# EAGLE schematic Mateusz.Płonka (EAGLE 9.5.1)
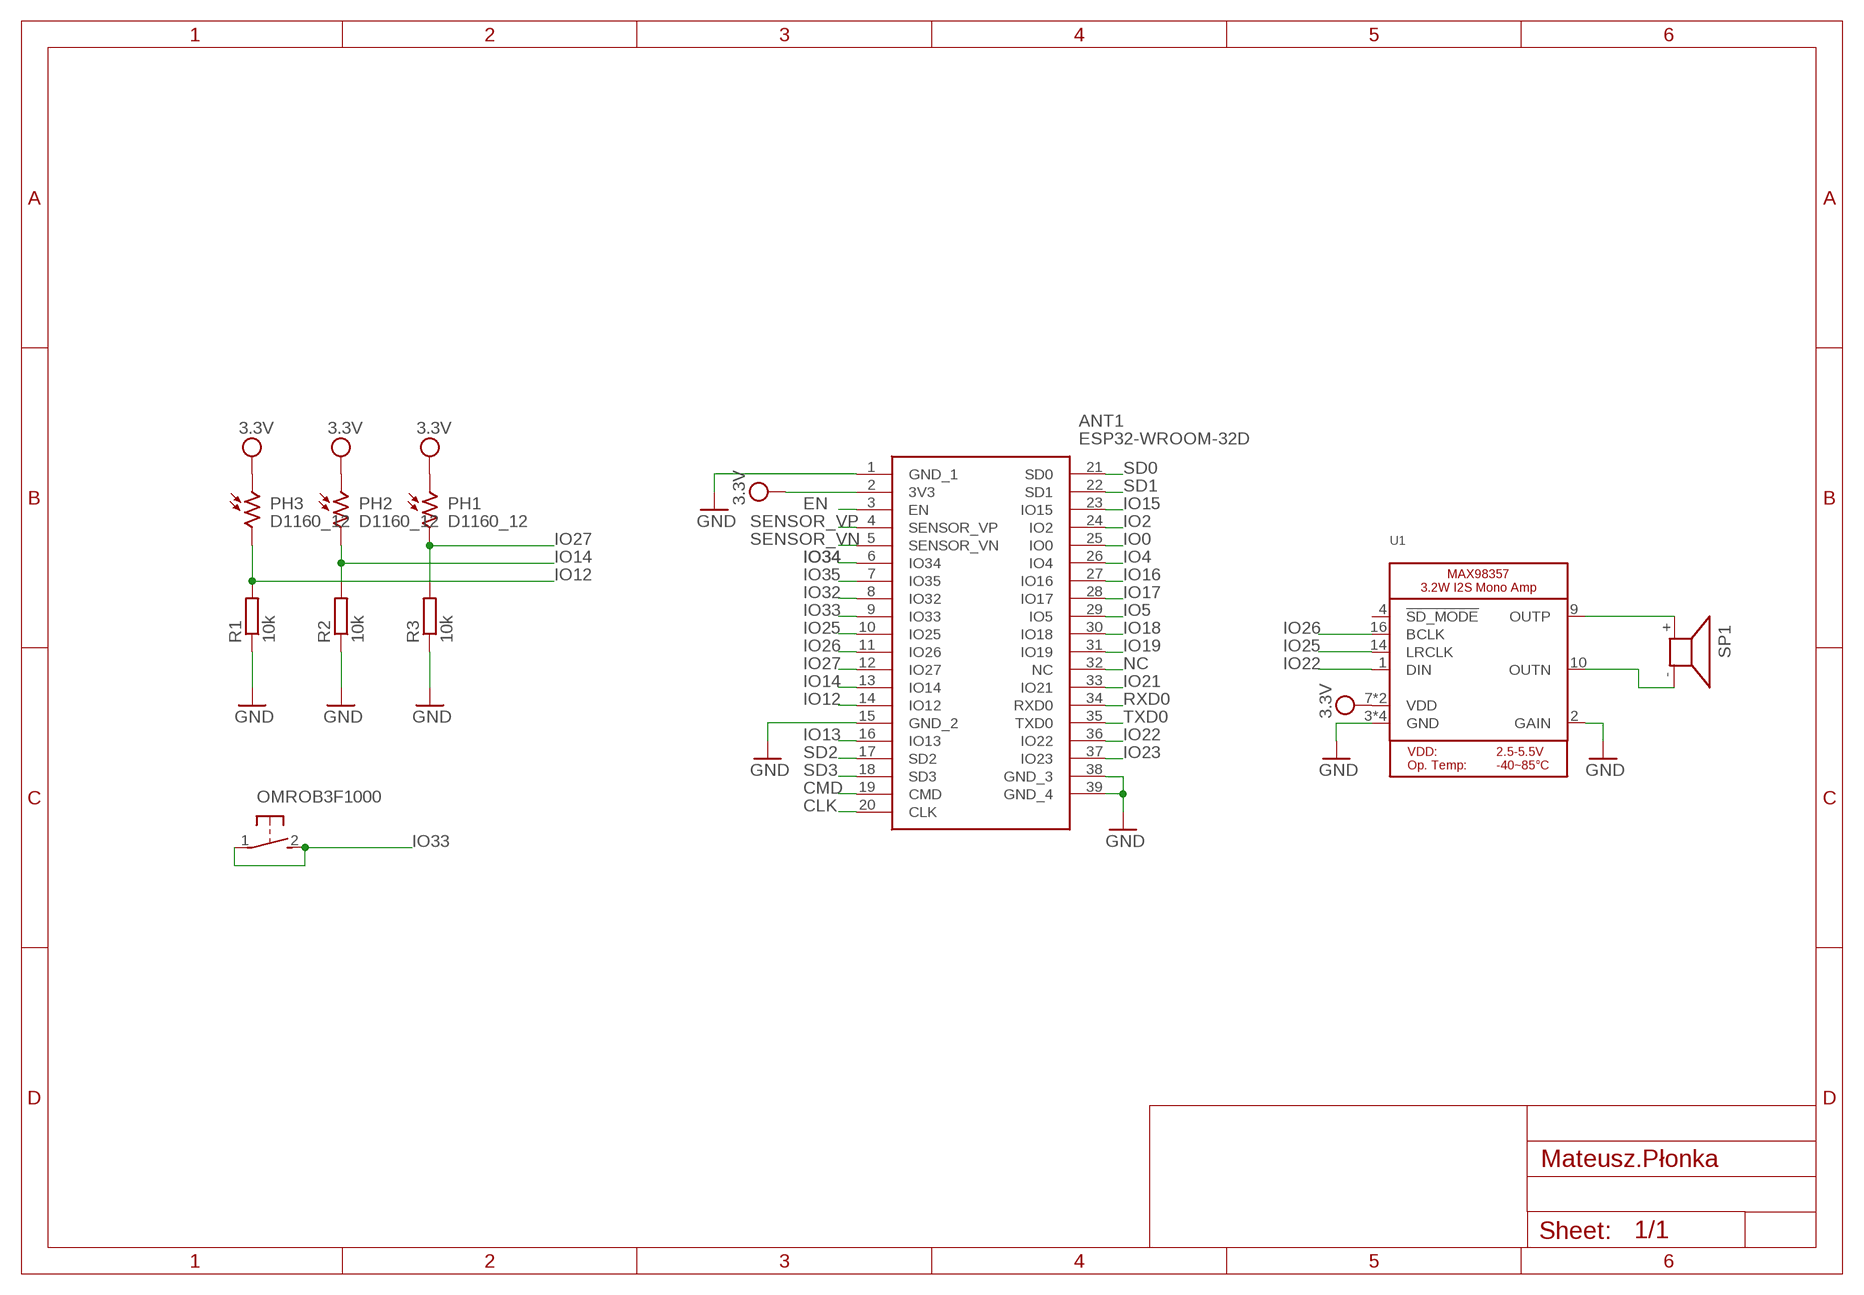
[diagram p0: schematic, sheet 1]

## Parts
ANT1  ESP32-WROOM-32D  [ESP32WROOM32D]
OMROB3F1000  31-XX  [B3F-31XX]
PH1  D1160_12  [D11XX]
PH2  D1160_12  [D11XX]
PH3  D1160_12  [D11XX]
R1  10k  R-EU_0207/5V  [0207/5V]
R2  10k  R-EU_0207/5V  [0207/5V]
R3  10k  R-EU_0207/5V  [0207/5V]
SP1  KSS1201  [KSS1201]
U1  MICROBUILDER_AUDIOAMP_MAX98357  [MICROBUILDER_QFN16_3MM]

## Nets
CLK: ANT1.20(CLK)
CMD: ANT1.19(CMD)
EN: ANT1.3(EN)
GND: ANT1.1(GND_1) R1.1 R2.1 R3.1 U1.2(GAIN) U1.3(GND) U1.11(GND) U1.15(GND) U1.THERMAL(GND)
IO0: ANT1.25(IO0)
IO2: ANT1.24(IO2)
IO4: ANT1.26(IO4)
IO5: ANT1.29(IO5)
IO12: ANT1.14(IO12) PH3.2 R1.2
IO13: ANT1.16(IO13)
IO14: ANT1.13(IO14) PH2.2 R2.2
IO15: ANT1.23(IO15)
IO16: ANT1.27(IO16)
IO17: ANT1.28(IO17)
IO18: ANT1.30(IO18)
IO19: ANT1.31(IO19)
IO21: ANT1.33(IO21)
IO22: ANT1.36(IO22) U1.1(DIN)
IO23: ANT1.37(IO23)
IO25: ANT1.10(IO25) U1.14(LRCLK)
IO26: ANT1.11(IO26) U1.16(BCLK)
IO27: ANT1.12(IO27) PH1.2 R3.2
IO32: ANT1.8(IO32)
IO33: ANT1.9(IO33) OMROB3F1000.1(P) OMROB3F1000.2(S)
IO34: ANT1.6(IO34)
IO35: ANT1.7(IO35)
N$4: SP1.- U1.10(OUTN)
N$5: SP1.+ U1.9(OUTP)
N$7: ANT1.38(GND_3) ANT1.39(GND_4) ; supply symbol labelled GND
N$19: ANT1.15(GND_2) ; supply symbol labelled GND
NC: ANT1.32(NC)
RXD0: ANT1.34(RXD0)
SD0: ANT1.21(SD0)
SD1: ANT1.22(SD1)
SD2: ANT1.17(SD2)
SD3: ANT1.18(SD3)
SENSOR_VN: ANT1.5(SENSOR_VN)
SENSOR_VP: ANT1.4(SENSOR_VP)
TXD0: ANT1.35(TXD0)
VCC: ANT1.2(3V3) PH1.1 PH2.1 PH3.1 U1.7(VDD) U1.8(VDD) ; supply symbol labelled 3.3V
Unconnected: U1.4(!SD_MODE)

## Library data of the parts
ANT1 = ESP32-WROOM-32D:ESP32-WROOM-32D: WiFi Modules (802.11) SMD Module, ESP32-D0WD, 32Mbits SPI flash, UART mode, PCB antenna Source: Datasheet <https://www.mouser.com/datasheet/2/891/esp32-wroom-32d_esp32-wroom-32u_datasheet_en-1365844.pdf>; DESCRIPTION: WiFi Modules (802.11) SMD Module, ESP32-D0WD, 32Mbits SPI flash, UART mode, PCB antenna; HEIGHT: 3.1mm; MANUFACTURER_NAME: Espressif; MANUFACTURER_PART_NUMBER: ESP32-WROOM-32D; MOUSER_PART_NUMBER: 356-ESP32WROOM-32D
OMROB3F1000 = switch-omron:31-XX: OMRON SWITCH; MPN: B3F-3100; OC_FARNELL: 959704; OC_NEWARK: 36M3582
PH1-PH3 = photo-elements:D11: Photo Sensor Oil Burner Control Applications Source: http://optoelectronics.perkinelmer.com/content/Datasheets/DTS_PhotocellsD1160.pdf
R1-R3 = rcl:R-EU_: RESISTOR, European symbol; SPICEPREFIX: R
SP1 = buzzer:KSS1201: SPEAKER Source: Schukat; OC_FARNELL: unknown; OC_NEWARK: unknown
U1 = Adafruit MAX98357 Breakout:MICROBUILDER_AUDIOAMP_MAX98357: MAX98357 - 3.2W I2S Mono Audio Amp